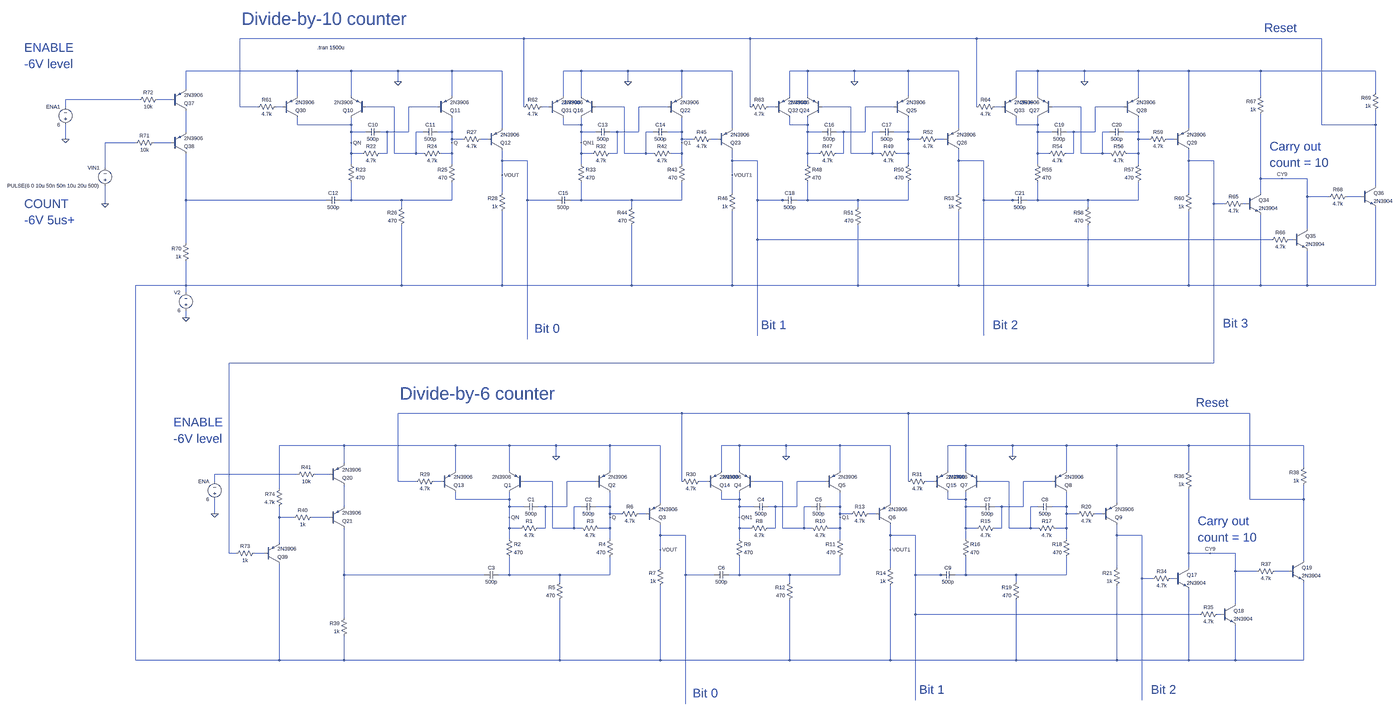
[diagram p0: schematic counter_div60.asc, whole sheet]
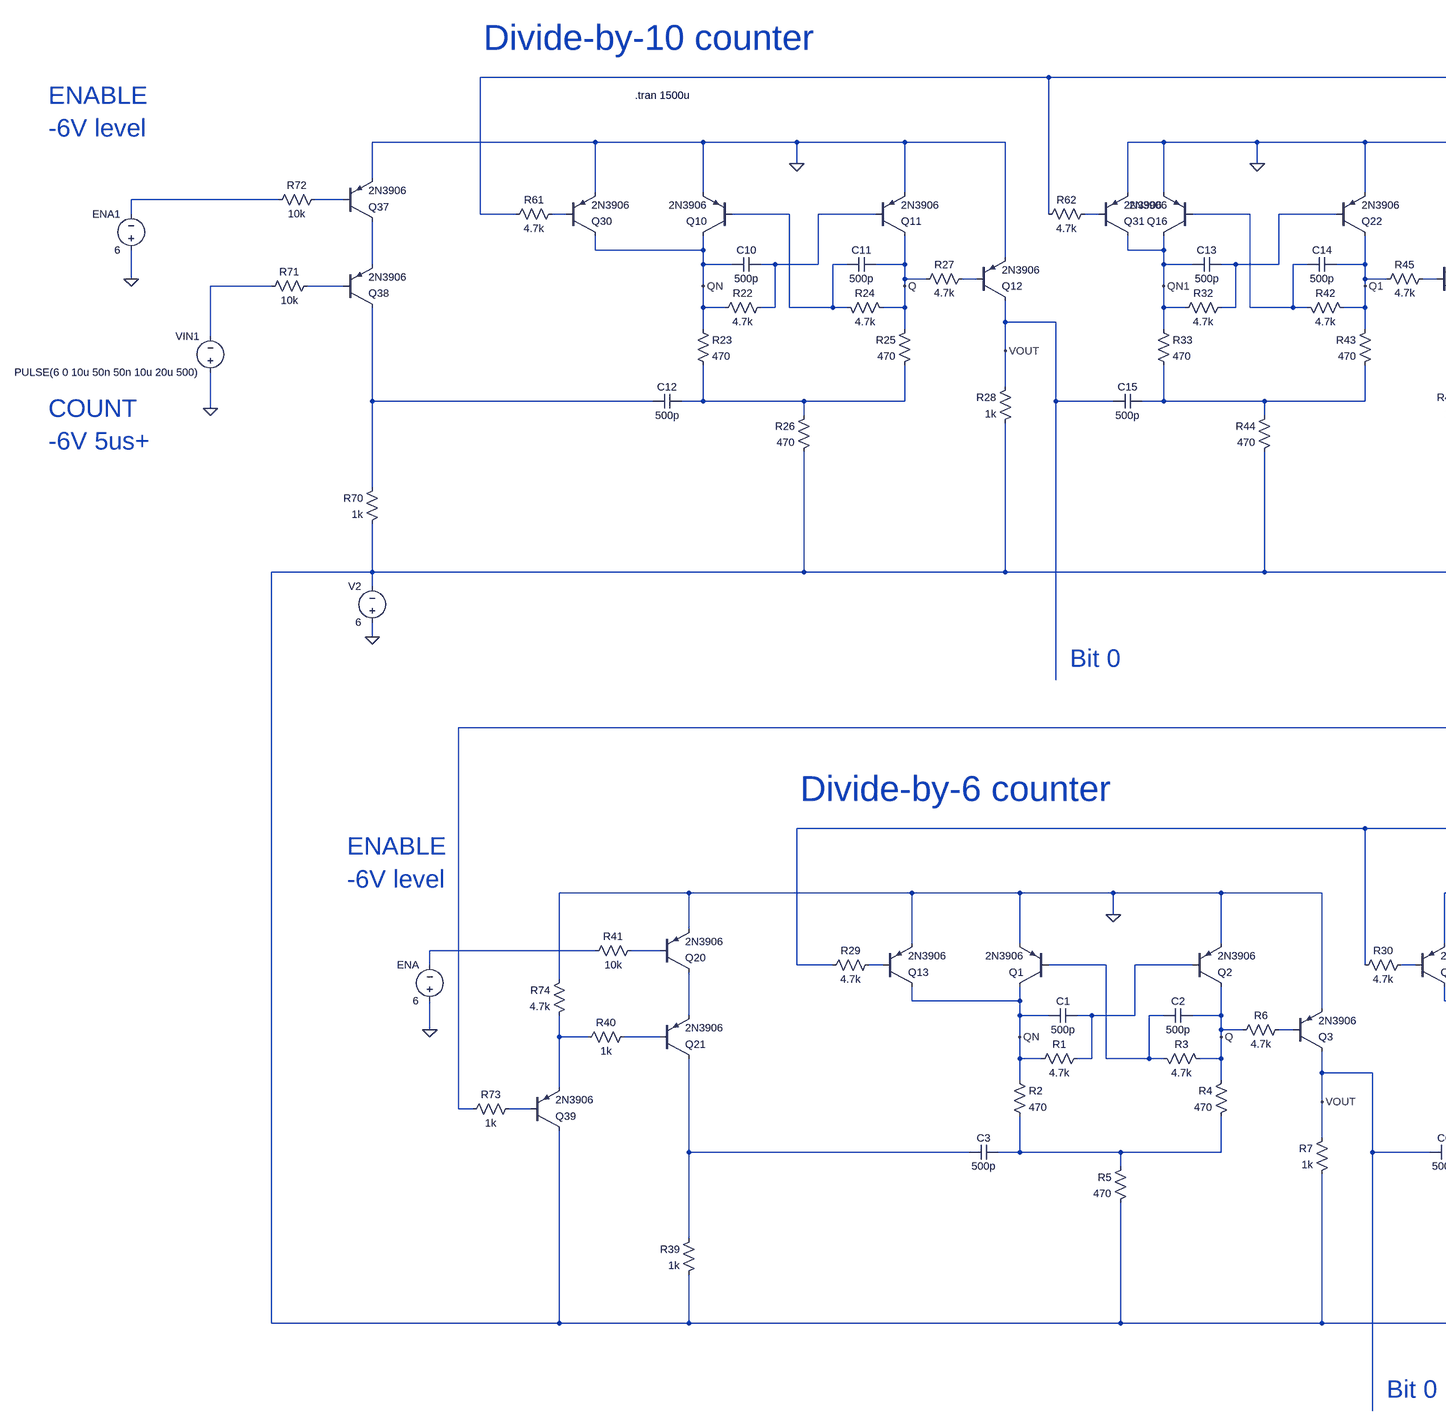
[diagram p1: schematic counter_div60.asc, part, row 1 of 1, column 1 of 2]
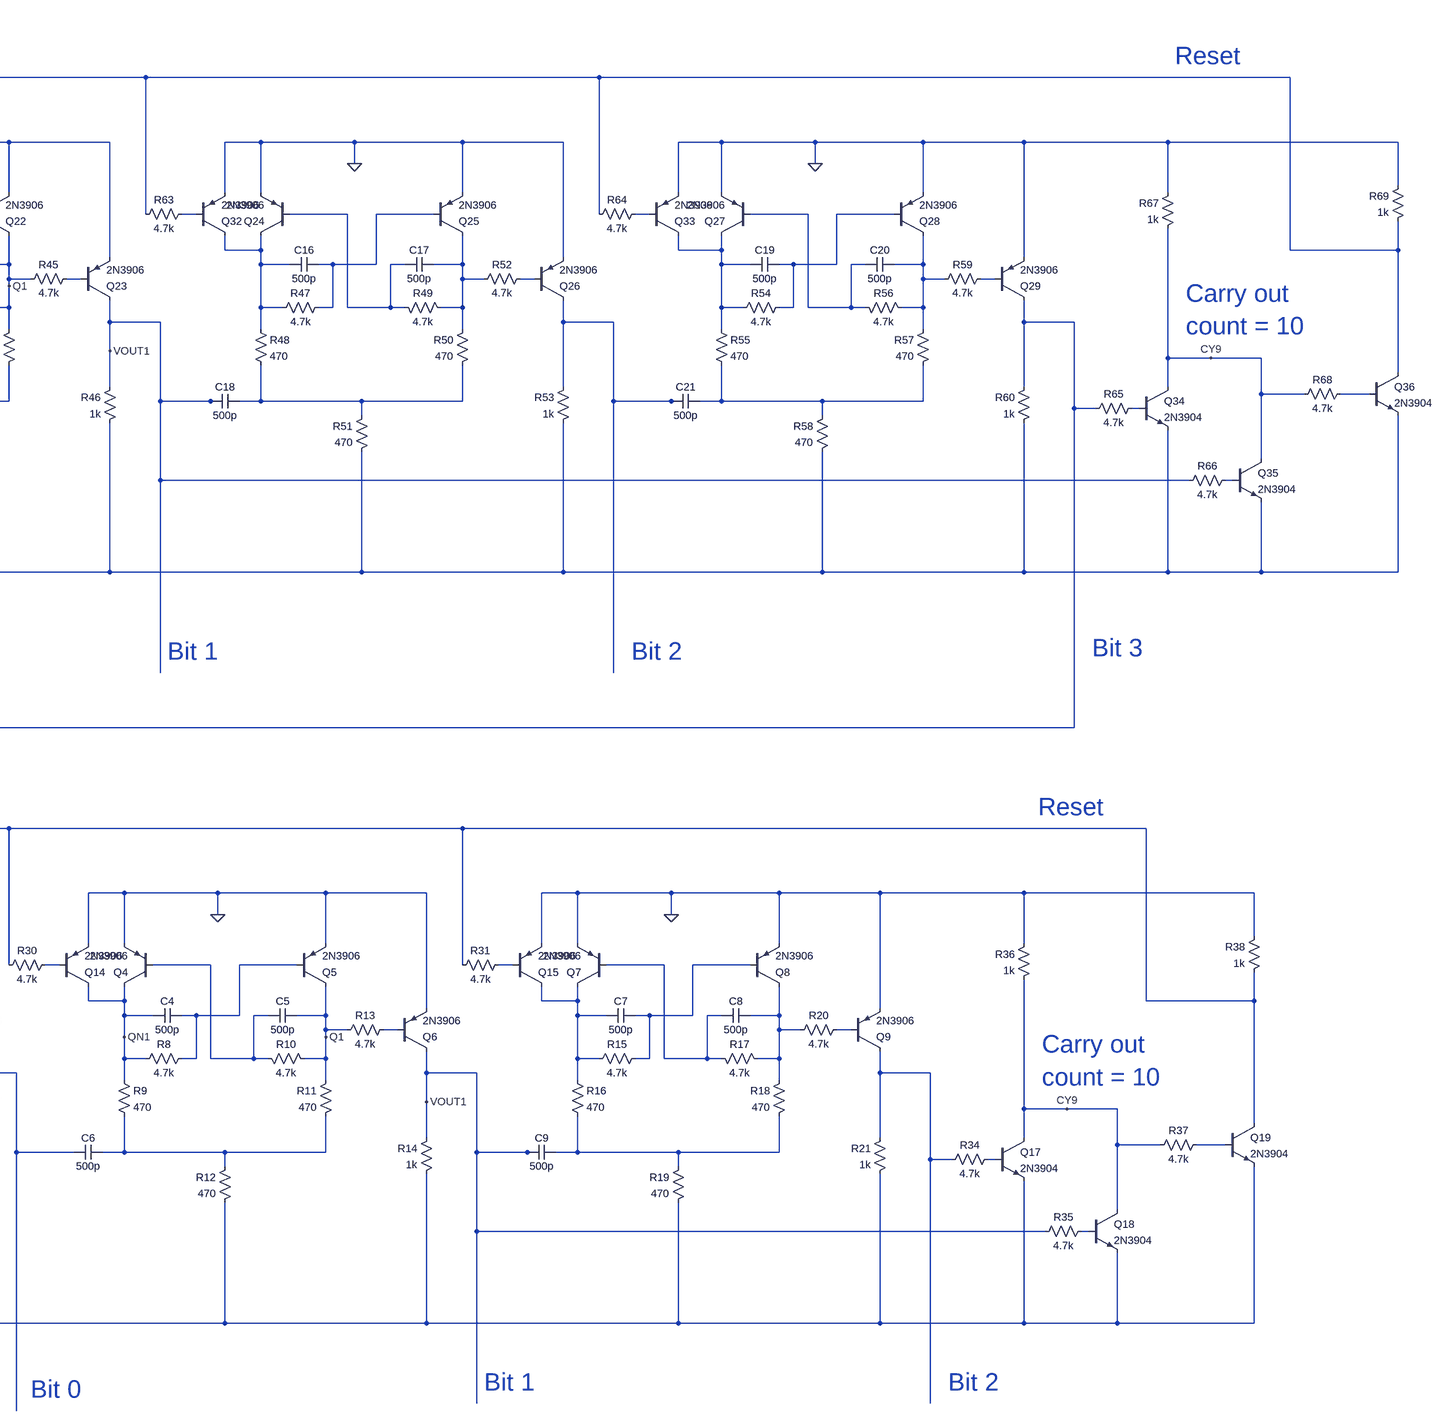
[diagram p2: schematic counter_div60.asc, part, row 1 of 1, column 2 of 2]
counter_div60.asc, the LTspice schematic file:
Version 4
SHEET 1 4888 1684
WIRE -16 -1984 -1280 -1984
WIRE 992 -1984 -16 -1984
WIRE 2000 -1984 992 -1984
WIRE 3536 -1984 2000 -1984
WIRE -1024 -1840 -1520 -1840
WIRE -784 -1840 -1024 -1840
WIRE -576 -1840 -784 -1840
WIRE -336 -1840 -576 -1840
WIRE -112 -1840 -336 -1840
WIRE 240 -1840 160 -1840
WIRE 448 -1840 240 -1840
WIRE 688 -1840 448 -1840
WIRE 912 -1840 688 -1840
WIRE 1248 -1840 1168 -1840
WIRE 1456 -1840 1248 -1840
WIRE 1696 -1840 1456 -1840
WIRE 1920 -1840 1696 -1840
WIRE 2272 -1840 2176 -1840
WIRE 2480 -1840 2272 -1840
WIRE 2720 -1840 2480 -1840
WIRE 2944 -1840 2720 -1840
WIRE 3264 -1840 2944 -1840
WIRE 3776 -1840 3264 -1840
WIRE -576 -1792 -576 -1840
WIRE 448 -1792 448 -1840
WIRE 1456 -1792 1456 -1840
WIRE 2480 -1792 2480 -1840
WIRE -1520 -1760 -1520 -1840
WIRE 3776 -1744 3776 -1840
WIRE -1024 -1728 -1024 -1840
WIRE -784 -1728 -784 -1840
WIRE -336 -1728 -336 -1840
WIRE 160 -1728 160 -1840
WIRE 240 -1728 240 -1840
WIRE 688 -1728 688 -1840
WIRE 1168 -1728 1168 -1840
WIRE 1248 -1728 1248 -1840
WIRE 1696 -1728 1696 -1840
WIRE 2176 -1728 2176 -1840
WIRE 2272 -1728 2272 -1840
WIRE 2720 -1728 2720 -1840
WIRE 3264 -1728 3264 -1840
WIRE -1728 -1712 -2096 -1712
WIRE -1584 -1712 -1648 -1712
WIRE -2096 -1680 -2096 -1712
WIRE -1280 -1680 -1280 -1984
WIRE -1200 -1680 -1280 -1680
WIRE -1088 -1680 -1120 -1680
WIRE -592 -1680 -720 -1680
WIRE -400 -1680 -528 -1680
WIRE -16 -1680 -16 -1984
WIRE 96 -1680 64 -1680
WIRE 432 -1680 304 -1680
WIRE 624 -1680 496 -1680
WIRE 992 -1680 992 -1984
WIRE 1104 -1680 1072 -1680
WIRE 1440 -1680 1312 -1680
WIRE 1632 -1680 1504 -1680
WIRE 2000 -1680 2000 -1984
WIRE 2112 -1680 2080 -1680
WIRE 2464 -1680 2336 -1680
WIRE 2656 -1680 2528 -1680
WIRE -1024 -1600 -1024 -1632
WIRE -784 -1600 -784 -1632
WIRE -784 -1600 -1024 -1600
WIRE 160 -1600 160 -1632
WIRE 240 -1600 240 -1632
WIRE 240 -1600 160 -1600
WIRE 1168 -1600 1168 -1632
WIRE 1248 -1600 1248 -1632
WIRE 1248 -1600 1168 -1600
WIRE 2176 -1600 2176 -1632
WIRE 2272 -1600 2272 -1632
WIRE 2272 -1600 2176 -1600
WIRE 3536 -1600 3536 -1984
WIRE 3776 -1600 3776 -1664
WIRE 3776 -1600 3536 -1600
WIRE -112 -1584 -112 -1840
WIRE 912 -1584 912 -1840
WIRE 1920 -1584 1920 -1840
WIRE 2944 -1584 2944 -1840
WIRE -1520 -1568 -1520 -1664
WIRE -784 -1568 -784 -1600
WIRE -720 -1568 -784 -1568
WIRE -624 -1568 -656 -1568
WIRE -528 -1568 -528 -1680
WIRE -528 -1568 -624 -1568
WIRE -464 -1568 -496 -1568
WIRE -336 -1568 -336 -1632
WIRE -336 -1568 -400 -1568
WIRE 240 -1568 240 -1600
WIRE 304 -1568 240 -1568
WIRE 400 -1568 368 -1568
WIRE 496 -1568 496 -1680
WIRE 496 -1568 400 -1568
WIRE 560 -1568 528 -1568
WIRE 688 -1568 688 -1632
WIRE 688 -1568 624 -1568
WIRE 1248 -1568 1248 -1600
WIRE 1312 -1568 1248 -1568
WIRE 1408 -1568 1376 -1568
WIRE 1504 -1568 1504 -1680
WIRE 1504 -1568 1408 -1568
WIRE 1568 -1568 1536 -1568
WIRE 1696 -1568 1696 -1632
WIRE 1696 -1568 1632 -1568
WIRE 2272 -1568 2272 -1600
WIRE 2336 -1568 2272 -1568
WIRE 2432 -1568 2400 -1568
WIRE 2528 -1568 2528 -1680
WIRE 2528 -1568 2432 -1568
WIRE 2592 -1568 2560 -1568
WIRE 2720 -1568 2720 -1632
WIRE 2720 -1568 2656 -1568
WIRE -2096 -1536 -2096 -1600
WIRE -336 -1536 -336 -1568
WIRE -288 -1536 -336 -1536
WIRE -176 -1536 -208 -1536
WIRE 688 -1536 688 -1568
WIRE 736 -1536 688 -1536
WIRE 848 -1536 816 -1536
WIRE 1696 -1536 1696 -1568
WIRE 1744 -1536 1696 -1536
WIRE 1856 -1536 1824 -1536
WIRE 2720 -1536 2720 -1568
WIRE 2768 -1536 2720 -1536
WIRE 2880 -1536 2848 -1536
WIRE -1744 -1520 -1920 -1520
WIRE -1584 -1520 -1664 -1520
WIRE -784 -1520 -784 -1568
WIRE -336 -1520 -336 -1536
WIRE 240 -1520 240 -1568
WIRE 688 -1520 688 -1536
WIRE -784 -1472 -784 -1520
WIRE -736 -1472 -784 -1472
WIRE -624 -1472 -624 -1568
WIRE -624 -1472 -656 -1472
WIRE -592 -1472 -592 -1680
WIRE -496 -1472 -496 -1568
WIRE -496 -1472 -592 -1472
WIRE -464 -1472 -496 -1472
WIRE -336 -1472 -336 -1520
WIRE -336 -1472 -384 -1472
WIRE 240 -1472 240 -1520
WIRE 288 -1472 240 -1472
WIRE 400 -1472 400 -1568
WIRE 400 -1472 368 -1472
WIRE 432 -1472 432 -1680
WIRE 528 -1472 528 -1568
WIRE 528 -1472 432 -1472
WIRE 560 -1472 528 -1472
WIRE 688 -1472 688 -1520
WIRE 688 -1472 640 -1472
WIRE 1248 -1472 1248 -1568
WIRE 1296 -1472 1248 -1472
WIRE 1408 -1472 1408 -1568
WIRE 1408 -1472 1376 -1472
WIRE 1440 -1472 1440 -1680
WIRE 1536 -1472 1536 -1568
WIRE 1536 -1472 1440 -1472
WIRE 1568 -1472 1536 -1472
WIRE 1696 -1472 1696 -1536
WIRE 1696 -1472 1648 -1472
WIRE 2272 -1472 2272 -1568
WIRE 2320 -1472 2272 -1472
WIRE 2432 -1472 2432 -1568
WIRE 2432 -1472 2400 -1472
WIRE 2464 -1472 2464 -1680
WIRE 2560 -1472 2560 -1568
WIRE 2560 -1472 2464 -1472
WIRE 2592 -1472 2560 -1472
WIRE 2720 -1472 2720 -1536
WIRE 2720 -1472 2672 -1472
WIRE -112 -1440 -112 -1488
WIRE 0 -1440 -112 -1440
WIRE 912 -1440 912 -1488
WIRE 1024 -1440 912 -1440
WIRE 1920 -1440 1920 -1488
WIRE 2032 -1440 1920 -1440
WIRE 2944 -1440 2944 -1488
WIRE 3056 -1440 2944 -1440
WIRE -784 -1424 -784 -1472
WIRE -336 -1424 -336 -1472
WIRE 240 -1424 240 -1472
WIRE 688 -1424 688 -1472
WIRE 1248 -1424 1248 -1472
WIRE 1696 -1424 1696 -1472
WIRE 2272 -1424 2272 -1472
WIRE 2720 -1424 2720 -1472
WIRE -1920 -1408 -1920 -1520
WIRE -112 -1376 -112 -1440
WIRE 912 -1376 912 -1440
WIRE 3264 -1360 3264 -1648
WIRE 3360 -1360 3264 -1360
WIRE 3472 -1360 3360 -1360
WIRE 3776 -1328 3776 -1600
WIRE -112 -1296 -112 -1376
WIRE 912 -1296 912 -1376
WIRE 1920 -1296 1920 -1440
WIRE 2944 -1296 2944 -1440
WIRE 3264 -1296 3264 -1360
WIRE 3472 -1280 3472 -1360
WIRE 3568 -1280 3472 -1280
WIRE 3712 -1280 3648 -1280
WIRE -1520 -1264 -1520 -1472
WIRE -896 -1264 -1520 -1264
WIRE -784 -1264 -784 -1344
WIRE -784 -1264 -832 -1264
WIRE -560 -1264 -784 -1264
WIRE -336 -1264 -336 -1344
WIRE -336 -1264 -560 -1264
WIRE 0 -1264 0 -1440
WIRE 128 -1264 0 -1264
WIRE 240 -1264 240 -1344
WIRE 240 -1264 192 -1264
WIRE 464 -1264 240 -1264
WIRE 688 -1264 688 -1344
WIRE 688 -1264 464 -1264
WIRE 1024 -1264 1024 -1440
WIRE 1136 -1264 1024 -1264
WIRE 1152 -1264 1136 -1264
WIRE 1248 -1264 1248 -1344
WIRE 1248 -1264 1200 -1264
WIRE 1472 -1264 1248 -1264
WIRE 1696 -1264 1696 -1344
WIRE 1696 -1264 1472 -1264
WIRE 2032 -1264 2032 -1440
WIRE 2160 -1264 2032 -1264
WIRE 2176 -1264 2160 -1264
WIRE 2272 -1264 2272 -1344
WIRE 2272 -1264 2224 -1264
WIRE 2496 -1264 2272 -1264
WIRE 2720 -1264 2720 -1344
WIRE 2720 -1264 2496 -1264
WIRE -1920 -1248 -1920 -1328
WIRE 3056 -1248 3056 -1440
WIRE 3104 -1248 3056 -1248
WIRE 3200 -1248 3184 -1248
WIRE -560 -1232 -560 -1264
WIRE 464 -1232 464 -1264
WIRE 1472 -1232 1472 -1264
WIRE 2496 -1232 2496 -1264
WIRE 3472 -1136 3472 -1280
WIRE 1024 -1088 1024 -1264
WIRE 3312 -1088 1024 -1088
WIRE 3408 -1088 3392 -1088
WIRE -1520 -1072 -1520 -1264
WIRE -1520 -864 -1520 -992
WIRE -1520 -864 -1744 -864
WIRE -560 -864 -560 -1152
WIRE -560 -864 -1520 -864
WIRE -112 -864 -112 -1216
WIRE -112 -864 -560 -864
WIRE 464 -864 464 -1152
WIRE 464 -864 -112 -864
WIRE 912 -864 912 -1216
WIRE 912 -864 464 -864
WIRE 1472 -864 1472 -1152
WIRE 1472 -864 912 -864
WIRE 1920 -864 1920 -1216
WIRE 1920 -864 1472 -864
WIRE 2496 -864 2496 -1152
WIRE 2496 -864 1920 -864
WIRE 2944 -864 2944 -1216
WIRE 2944 -864 2496 -864
WIRE 3264 -864 3264 -1200
WIRE 3264 -864 2944 -864
WIRE 3472 -864 3472 -1040
WIRE 3472 -864 3264 -864
WIRE 3776 -864 3776 -1232
WIRE 3776 -864 3472 -864
WIRE -1520 -832 -1520 -864
WIRE -1520 -720 -1520 -752
WIRE 1024 -640 1024 -1088
WIRE 2032 -640 2032 -1264
WIRE 0 -624 0 -1264
WIRE 3056 -448 3056 -1248
WIRE 3056 -448 -1328 -448
WIRE 688 -96 -576 -96
WIRE 1696 -96 688 -96
WIRE 3216 -96 1696 -96
WIRE -816 48 -1104 48
WIRE -320 48 -816 48
WIRE -80 48 -320 48
WIRE 128 48 -80 48
WIRE 368 48 128 48
WIRE 592 48 368 48
WIRE 944 48 864 48
WIRE 1152 48 944 48
WIRE 1392 48 1152 48
WIRE 1616 48 1392 48
WIRE 1952 48 1872 48
WIRE 2160 48 1952 48
WIRE 2400 48 2160 48
WIRE 2624 48 2400 48
WIRE 2944 48 2624 48
WIRE 3456 48 2944 48
WIRE 128 96 128 48
WIRE 1152 96 1152 48
WIRE 2160 96 2160 48
WIRE -816 128 -816 48
WIRE 3456 144 3456 48
WIRE -320 160 -320 48
WIRE -80 160 -80 48
WIRE 368 160 368 48
WIRE 864 160 864 48
WIRE 944 160 944 48
WIRE 1392 160 1392 48
WIRE 1872 160 1872 48
WIRE 1952 160 1952 48
WIRE 2400 160 2400 48
WIRE 2944 160 2944 48
WIRE -1024 176 -1392 176
WIRE -880 176 -944 176
WIRE -1392 208 -1392 176
WIRE -576 208 -576 -96
WIRE -496 208 -576 208
WIRE -384 208 -416 208
WIRE 112 208 -16 208
WIRE 304 208 176 208
WIRE 688 208 688 -96
WIRE 800 208 768 208
WIRE 1136 208 1008 208
WIRE 1328 208 1200 208
WIRE 1696 208 1696 -96
WIRE 1808 208 1776 208
WIRE 2144 208 2016 208
WIRE 2336 208 2208 208
WIRE -1104 240 -1104 48
WIRE -320 288 -320 256
WIRE -80 288 -80 256
WIRE -80 288 -320 288
WIRE 864 288 864 256
WIRE 944 288 944 256
WIRE 944 288 864 288
WIRE 1872 288 1872 256
WIRE 1952 288 1952 256
WIRE 1952 288 1872 288
WIRE 3216 288 3216 -96
WIRE 3456 288 3456 224
WIRE 3456 288 3216 288
WIRE 592 304 592 48
WIRE 1616 304 1616 48
WIRE 2624 304 2624 48
WIRE -816 320 -816 224
WIRE -80 320 -80 288
WIRE -16 320 -80 320
WIRE 80 320 48 320
WIRE 176 320 176 208
WIRE 176 320 80 320
WIRE 240 320 208 320
WIRE 368 320 368 256
WIRE 368 320 304 320
WIRE 944 320 944 288
WIRE 1008 320 944 320
WIRE 1104 320 1072 320
WIRE 1200 320 1200 208
WIRE 1200 320 1104 320
WIRE 1264 320 1232 320
WIRE 1392 320 1392 256
WIRE 1392 320 1328 320
WIRE 1952 320 1952 288
WIRE 2016 320 1952 320
WIRE 2112 320 2080 320
WIRE 2208 320 2208 208
WIRE 2208 320 2112 320
WIRE 2272 320 2240 320
WIRE 2400 320 2400 256
WIRE 2400 320 2336 320
WIRE -1392 352 -1392 288
WIRE 368 352 368 320
WIRE 416 352 368 352
WIRE 528 352 496 352
WIRE 1392 352 1392 320
WIRE 1440 352 1392 352
WIRE 1552 352 1520 352
WIRE 2400 352 2400 320
WIRE 2448 352 2400 352
WIRE 2560 352 2528 352
WIRE -1104 368 -1104 320
WIRE -1040 368 -1104 368
WIRE -880 368 -960 368
WIRE -80 368 -80 320
WIRE 368 368 368 352
WIRE 944 368 944 320
WIRE 1392 368 1392 352
WIRE -80 416 -80 368
WIRE -32 416 -80 416
WIRE 80 416 80 320
WIRE 80 416 48 416
WIRE 112 416 112 208
WIRE 208 416 208 320
WIRE 208 416 112 416
WIRE 240 416 208 416
WIRE 368 416 368 368
WIRE 368 416 320 416
WIRE 944 416 944 368
WIRE 992 416 944 416
WIRE 1104 416 1104 320
WIRE 1104 416 1072 416
WIRE 1136 416 1136 208
WIRE 1232 416 1232 320
WIRE 1232 416 1136 416
WIRE 1264 416 1232 416
WIRE 1392 416 1392 368
WIRE 1392 416 1344 416
WIRE 1952 416 1952 320
WIRE 2000 416 1952 416
WIRE 2112 416 2112 320
WIRE 2112 416 2080 416
WIRE 2144 416 2144 208
WIRE 2240 416 2240 320
WIRE 2240 416 2144 416
WIRE 2272 416 2240 416
WIRE 2400 416 2400 352
WIRE 2400 416 2352 416
WIRE 592 448 592 400
WIRE 704 448 592 448
WIRE 1616 448 1616 400
WIRE 1728 448 1616 448
WIRE 2624 448 2624 400
WIRE 2736 448 2624 448
WIRE -80 464 -80 416
WIRE 368 464 368 416
WIRE 944 464 944 416
WIRE 1392 464 1392 416
WIRE 1952 464 1952 416
WIRE 2400 464 2400 416
WIRE -1104 480 -1104 368
WIRE 592 512 592 448
WIRE 1616 512 1616 448
WIRE -1328 528 -1328 -448
WIRE -1296 528 -1328 528
WIRE -1168 528 -1216 528
WIRE 2944 528 2944 240
WIRE 3040 528 2944 528
WIRE 3152 528 3040 528
WIRE 3456 560 3456 288
WIRE 592 592 592 512
WIRE 1616 592 1616 512
WIRE 2624 592 2624 448
WIRE 2944 592 2944 528
WIRE 3152 608 3152 528
WIRE 3248 608 3152 608
WIRE 3392 608 3328 608
WIRE -816 624 -816 416
WIRE -192 624 -816 624
WIRE -80 624 -80 544
WIRE -80 624 -128 624
WIRE 144 624 -80 624
WIRE 368 624 368 544
WIRE 368 624 144 624
WIRE 704 624 704 448
WIRE 832 624 704 624
WIRE 944 624 944 544
WIRE 944 624 896 624
WIRE 1168 624 944 624
WIRE 1392 624 1392 544
WIRE 1392 624 1168 624
WIRE 1728 624 1728 448
WIRE 1840 624 1728 624
WIRE 1856 624 1840 624
WIRE 1952 624 1952 544
WIRE 1952 624 1904 624
WIRE 2176 624 1952 624
WIRE 2400 624 2400 544
WIRE 2400 624 2176 624
WIRE 2736 640 2736 448
WIRE 2784 640 2736 640
WIRE 2880 640 2864 640
WIRE 144 656 144 624
WIRE 1168 656 1168 624
WIRE 2176 656 2176 624
WIRE 3152 752 3152 608
WIRE 1728 800 1728 624
WIRE 2992 800 1728 800
WIRE 3088 800 3072 800
WIRE -816 816 -816 624
WIRE -1744 1024 -1744 -864
WIRE -1104 1024 -1104 576
WIRE -1104 1024 -1744 1024
WIRE -816 1024 -816 896
WIRE -816 1024 -1104 1024
WIRE 144 1024 144 736
WIRE 144 1024 -816 1024
WIRE 592 1024 592 672
WIRE 592 1024 144 1024
WIRE 1168 1024 1168 736
WIRE 1168 1024 592 1024
WIRE 1616 1024 1616 672
WIRE 1616 1024 1168 1024
WIRE 2176 1024 2176 736
WIRE 2176 1024 1616 1024
WIRE 2624 1024 2624 672
WIRE 2624 1024 2176 1024
WIRE 2944 1024 2944 688
WIRE 2944 1024 2624 1024
WIRE 3152 1024 3152 848
WIRE 3152 1024 2944 1024
WIRE 3456 1024 3456 656
WIRE 3456 1024 3152 1024
WIRE 1728 1248 1728 800
WIRE 2736 1248 2736 640
WIRE 704 1264 704 624
FLAG 128 96 0
FLAG 368 368 Q
FLAG -80 368 QN
FLAG 592 512 VOUT
FLAG 1152 96 0
FLAG 1392 368 Q1
FLAG 944 368 QN1
FLAG 1616 512 VOUT1
FLAG 2160 96 0
FLAG 3040 528 CY9
FLAG -1392 352 0
FLAG -576 -1792 0
FLAG -1520 -720 0
FLAG -1920 -1248 0
FLAG -336 -1520 Q
FLAG -784 -1520 QN
FLAG -112 -1376 VOUT
FLAG 448 -1792 0
FLAG 688 -1520 Q1
FLAG 240 -1520 QN1
FLAG 912 -1376 VOUT1
FLAG 1456 -1792 0
FLAG 2480 -1792 0
FLAG 3360 -1360 CY9
FLAG -2096 -1536 0
SYMBOL pnp -16 256 R180
SYMATTR InstName Q1
SYMATTR Value 2N3906
SYMBOL cap 48 304 R90
WINDOW 0 0 32 VBottom 2
WINDOW 3 32 32 VTop 2
SYMATTR InstName C1
SYMATTR Value 500p
SYMBOL res 64 400 R90
WINDOW 0 0 56 VBottom 2
WINDOW 3 32 56 VTop 2
SYMATTR InstName R1
SYMATTR Value 4.7k
SYMBOL res -96 448 R0
SYMATTR InstName R2
SYMATTR Value 470
SYMBOL pnp 304 256 M180
SYMATTR InstName Q2
SYMATTR Value 2N3906
SYMBOL cap 240 304 M90
WINDOW 0 0 32 VBottom 2
WINDOW 3 32 32 VTop 2
SYMATTR InstName C2
SYMATTR Value 500p
SYMBOL res 224 400 M90
WINDOW 0 0 56 VBottom 2
WINDOW 3 32 56 VTop 2
SYMATTR InstName R3
SYMATTR Value 4.7k
SYMBOL res 384 448 M0
SYMATTR InstName R4
SYMATTR Value 470
SYMBOL res 160 640 M0
SYMATTR InstName R5
SYMATTR Value 470
SYMBOL cap -128 608 R90
WINDOW 0 0 32 VBottom 2
WINDOW 3 32 32 VTop 2
SYMATTR InstName C3
SYMATTR Value 500p
SYMBOL pnp 528 400 M180
SYMATTR InstName Q3
SYMATTR Value 2N3906
SYMBOL res 512 336 R90
WINDOW 0 0 56 VBottom 2
WINDOW 3 32 56 VTop 2
SYMATTR InstName R6
SYMATTR Value 4.7k
SYMBOL res 608 576 M0
SYMATTR InstName R7
SYMATTR Value 1k
SYMBOL pnp 1008 256 R180
SYMATTR InstName Q4
SYMATTR Value 2N3906
SYMBOL cap 1072 304 R90
WINDOW 0 0 32 VBottom 2
WINDOW 3 32 32 VTop 2
SYMATTR InstName C4
SYMATTR Value 500p
SYMBOL res 1088 400 R90
WINDOW 0 0 56 VBottom 2
WINDOW 3 32 56 VTop 2
SYMATTR InstName R8
SYMATTR Value 4.7k
SYMBOL res 928 448 R0
SYMATTR InstName R9
SYMATTR Value 470
SYMBOL pnp 1328 256 M180
SYMATTR InstName Q5
SYMATTR Value 2N3906
SYMBOL cap 1264 304 M90
WINDOW 0 0 32 VBottom 2
WINDOW 3 32 32 VTop 2
SYMATTR InstName C5
SYMATTR Value 500p
SYMBOL res 1248 400 M90
WINDOW 0 0 56 VBottom 2
WINDOW 3 32 56 VTop 2
SYMATTR InstName R10
SYMATTR Value 4.7k
SYMBOL res 1408 448 M0
SYMATTR InstName R11
SYMATTR Value 470
SYMBOL res 1184 640 M0
SYMATTR InstName R12
SYMATTR Value 470
SYMBOL cap 896 608 R90
WINDOW 0 0 32 VBottom 2
WINDOW 3 32 32 VTop 2
SYMATTR InstName C6
SYMATTR Value 500p
SYMBOL pnp 1552 400 M180
SYMATTR InstName Q6
SYMATTR Value 2N3906
SYMBOL res 1536 336 R90
WINDOW 0 0 56 VBottom 2
WINDOW 3 32 56 VTop 2
SYMATTR InstName R13
SYMATTR Value 4.7k
SYMBOL res 1632 576 M0
SYMATTR InstName R14
SYMATTR Value 1k
SYMBOL pnp 2016 256 R180
SYMATTR InstName Q7
SYMATTR Value 2N3906
SYMBOL cap 2080 304 R90
WINDOW 0 0 32 VBottom 2
WINDOW 3 32 32 VTop 2
SYMATTR InstName C7
SYMATTR Value 500p
SYMBOL res 2096 400 R90
WINDOW 0 0 56 VBottom 2
WINDOW 3 32 56 VTop 2
SYMATTR InstName R15
SYMATTR Value 4.7k
SYMBOL res 1936 448 R0
SYMATTR InstName R16
SYMATTR Value 470
SYMBOL pnp 2336 256 M180
SYMATTR InstName Q8
SYMATTR Value 2N3906
SYMBOL cap 2272 304 M90
WINDOW 0 0 32 VBottom 2
WINDOW 3 32 32 VTop 2
SYMATTR InstName C8
SYMATTR Value 500p
SYMBOL res 2256 400 M90
WINDOW 0 0 56 VBottom 2
WINDOW 3 32 56 VTop 2
SYMATTR InstName R17
SYMATTR Value 4.7k
SYMBOL res 2416 448 M0
SYMATTR InstName R18
SYMATTR Value 470
SYMBOL res 2192 640 M0
SYMATTR InstName R19
SYMATTR Value 470
SYMBOL cap 1904 608 R90
WINDOW 0 0 32 VBottom 2
WINDOW 3 32 32 VTop 2
SYMATTR InstName C9
SYMATTR Value 500p
SYMBOL pnp 2560 400 M180
SYMATTR InstName Q9
SYMATTR Value 2N3906
SYMBOL res 2544 336 R90
WINDOW 0 0 56 VBottom 2
WINDOW 3 32 56 VTop 2
SYMATTR InstName R20
SYMATTR Value 4.7k
SYMBOL res 2640 576 M0
SYMATTR InstName R21
SYMATTR Value 1k
SYMBOL pnp -384 256 M180
SYMATTR InstName Q13
SYMATTR Value 2N3906
SYMBOL res -400 192 R90
WINDOW 0 0 56 VBottom 2
WINDOW 3 32 56 VTop 2
SYMATTR InstName R29
SYMATTR Value 4.7k
SYMBOL pnp 800 256 M180
SYMATTR InstName Q14
SYMATTR Value 2N3906
SYMBOL res 784 192 R90
WINDOW 0 0 56 VBottom 2
WINDOW 3 32 56 VTop 2
SYMATTR InstName R30
SYMATTR Value 4.7k
SYMBOL pnp 1808 256 M180
SYMATTR InstName Q15
SYMATTR Value 2N3906
SYMBOL res 1792 192 R90
WINDOW 0 0 56 VBottom 2
WINDOW 3 32 56 VTop 2
SYMATTR InstName R31
SYMATTR Value 4.7k
SYMBOL res 2880 624 R90
WINDOW 0 0 56 VBottom 2
WINDOW 3 32 56 VTop 2
SYMATTR InstName R34
SYMATTR Value 4.7k
SYMBOL res 3088 784 R90
WINDOW 0 0 56 VBottom 2
WINDOW 3 32 56 VTop 2
SYMATTR InstName R35
SYMATTR Value 4.7k
SYMBOL npn 2880 592 R0
SYMATTR InstName Q17
SYMATTR Value 2N3904
SYMBOL npn 3088 752 R0
SYMATTR InstName Q18
SYMATTR Value 2N3904
SYMBOL res 2960 144 M0
SYMATTR InstName R36
SYMATTR Value 1k
SYMBOL npn 3392 560 R0
SYMATTR InstName Q19
SYMATTR Value 2N3904
SYMBOL res 3344 592 R90
WINDOW 0 0 56 VBottom 2
WINDOW 3 32 56 VTop 2
SYMATTR InstName R37
SYMATTR Value 4.7k
SYMBOL res 3472 128 M0
SYMATTR InstName R38
SYMATTR Value 1k
SYMBOL pnp -880 224 M180
SYMATTR InstName Q20
SYMATTR Value 2N3906
SYMBOL pnp -880 416 M180
SYMATTR InstName Q21
SYMATTR Value 2N3906
SYMBOL res -800 800 M0
SYMATTR InstName R39
SYMATTR Value 1k
SYMBOL res -944 352 R90
WINDOW 0 0 56 VBottom 2
WINDOW 3 32 56 VTop 2
SYMATTR InstName R40
SYMATTR Value 1k
SYMBOL voltage -1392 304 R180
WINDOW 0 24 96 Left 2
WINDOW 3 24 16 Left 2
WINDOW 123 0 0 Left 0
WINDOW 39 0 0 Left 0
SYMATTR InstName ENA
SYMATTR Value 6
SYMBOL res -928 160 R90
WINDOW 0 0 56 VBottom 2
WINDOW 3 32 56 VTop 2
SYMATTR InstName R41
SYMATTR Value 10k
SYMBOL pnp -720 -1632 R180
SYMATTR InstName Q10
SYMATTR Value 2N3906
SYMBOL cap -656 -1584 R90
WINDOW 0 0 32 VBottom 2
WINDOW 3 32 32 VTop 2
SYMATTR InstName C10
SYMATTR Value 500p
SYMBOL res -640 -1488 R90
WINDOW 0 0 56 VBottom 2
WINDOW 3 32 56 VTop 2
SYMATTR InstName R22
SYMATTR Value 4.7k
SYMBOL res -800 -1440 R0
SYMATTR InstName R23
SYMATTR Value 470
SYMBOL pnp -400 -1632 M180
SYMATTR InstName Q11
SYMATTR Value 2N3906
SYMBOL cap -464 -1584 M90
WINDOW 0 0 32 VBottom 2
WINDOW 3 32 32 VTop 2
SYMATTR InstName C11
SYMATTR Value 500p
SYMBOL res -480 -1488 M90
WINDOW 0 0 56 VBottom 2
WINDOW 3 32 56 VTop 2
SYMATTR InstName R24
SYMATTR Value 4.7k
SYMBOL res -320 -1440 M0
SYMATTR InstName R25
SYMATTR Value 470
SYMBOL res -544 -1248 M0
SYMATTR InstName R26
SYMATTR Value 470
SYMBOL cap -832 -1280 R90
WINDOW 0 0 32 VBottom 2
WINDOW 3 32 32 VTop 2
SYMATTR InstName C12
SYMATTR Value 500p
SYMBOL voltage -1520 -736 R180
WINDOW 0 24 96 Left 2
WINDOW 3 24 16 Left 2
WINDOW 123 0 0 Left 0
WINDOW 39 0 0 Left 0
SYMATTR InstName V2
SYMATTR Value 6
SYMBOL voltage -1920 -1312 R180
WINDOW 0 24 96 Left 2
WINDOW 3 24 16 Left 2
WINDOW 123 0 0 Left 0
WINDOW 39 0 0 Left 0
SYMATTR InstName VIN1
SYMATTR Value PULSE(6 0 10u 50n 50n 10u 20u 500)
SYMBOL pnp -176 -1488 M180
SYMATTR InstName Q12
SYMATTR Value 2N3906
SYMBOL res -192 -1552 R90
WINDOW 0 0 56 VBottom 2
WINDOW 3 32 56 VTop 2
SYMATTR InstName R27
SYMATTR Value 4.7k
SYMBOL res -96 -1312 M0
SYMATTR InstName R28
SYMATTR Value 1k
SYMBOL pnp 304 -1632 R180
SYMATTR InstName Q16
SYMATTR Value 2N3906
SYMBOL cap 368 -1584 R90
WINDOW 0 0 32 VBottom 2
WINDOW 3 32 32 VTop 2
SYMATTR InstName C13
SYMATTR Value 500p
SYMBOL res 384 -1488 R90
WINDOW 0 0 56 VBottom 2
WINDOW 3 32 56 VTop 2
SYMATTR InstName R32
SYMATTR Value 4.7k
SYMBOL res 224 -1440 R0
SYMATTR InstName R33
SYMATTR Value 470
SYMBOL pnp 624 -1632 M180
SYMATTR InstName Q22
SYMATTR Value 2N3906
SYMBOL cap 560 -1584 M90
WINDOW 0 0 32 VBottom 2
WINDOW 3 32 32 VTop 2
SYMATTR InstName C14
SYMATTR Value 500p
SYMBOL res 544 -1488 M90
WINDOW 0 0 56 VBottom 2
WINDOW 3 32 56 VTop 2
SYMATTR InstName R42
SYMATTR Value 4.7k
SYMBOL res 704 -1440 M0
SYMATTR InstName R43
SYMATTR Value 470
SYMBOL res 480 -1248 M0
SYMATTR InstName R44
SYMATTR Value 470
SYMBOL cap 192 -1280 R90
WINDOW 0 0 32 VBottom 2
WINDOW 3 32 32 VTop 2
SYMATTR InstName C15
SYMATTR Value 500p
SYMBOL pnp 848 -1488 M180
SYMATTR InstName Q23
SYMATTR Value 2N3906
SYMBOL res 832 -1552 R90
WINDOW 0 0 56 VBottom 2
WINDOW 3 32 56 VTop 2
SYMATTR InstName R45
SYMATTR Value 4.7k
SYMBOL res 928 -1312 M0
SYMATTR InstName R46
SYMATTR Value 1k
SYMBOL pnp 1312 -1632 R180
SYMATTR InstName Q24
SYMATTR Value 2N3906
SYMBOL cap 1376 -1584 R90
WINDOW 0 0 32 VBottom 2
WINDOW 3 32 32 VTop 2
SYMATTR InstName C16
SYMATTR Value 500p
SYMBOL res 1392 -1488 R90
WINDOW 0 0 56 VBottom 2
WINDOW 3 32 56 VTop 2
SYMATTR InstName R47
SYMATTR Value 4.7k
SYMBOL res 1232 -1440 R0
SYMATTR InstName R48
SYMATTR Value 470
SYMBOL pnp 1632 -1632 M180
SYMATTR InstName Q25
SYMATTR Value 2N3906
SYMBOL cap 1568 -1584 M90
WINDOW 0 0 32 VBottom 2
WINDOW 3 32 32 VTop 2
SYMATTR InstName C17
SYMATTR Value 500p
SYMBOL res 1552 -1488 M90
WINDOW 0 0 56 VBottom 2
WINDOW 3 32 56 VTop 2
SYMATTR InstName R49
SYMATTR Value 4.7k
SYMBOL res 1712 -1440 M0
SYMATTR InstName R50
SYMATTR Value 470
SYMBOL res 1488 -1248 M0
SYMATTR InstName R51
SYMATTR Value 470
SYMBOL cap 1200 -1280 R90
WINDOW 0 0 32 VBottom 2
WINDOW 3 32 32 VTop 2
SYMATTR InstName C18
SYMATTR Value 500p
SYMBOL pnp 1856 -1488 M180
SYMATTR InstName Q26
SYMATTR Value 2N3906
SYMBOL res 1840 -1552 R90
WINDOW 0 0 56 VBottom 2
WINDOW 3 32 56 VTop 2
SYMATTR InstName R52
SYMATTR Value 4.7k
SYMBOL res 1936 -1312 M0
SYMATTR InstName R53
SYMATTR Value 1k
SYMBOL pnp 2336 -1632 R180
SYMATTR InstName Q27
SYMATTR Value 2N3906
SYMBOL cap 2400 -1584 R90
WINDOW 0 0 32 VBottom 2
WINDOW 3 32 32 VTop 2
SYMATTR InstName C19
SYMATTR Value 500p
SYMBOL res 2416 -1488 R90
WINDOW 0 0 56 VBottom 2
WINDOW 3 32 56 VTop 2
SYMATTR InstName R54
SYMATTR Value 4.7k
SYMBOL res 2256 -1440 R0
SYMATTR InstName R55
SYMATTR Value 470
SYMBOL pnp 2656 -1632 M180
SYMATTR InstName Q28
SYMATTR Value 2N3906
SYMBOL cap 2592 -1584 M90
WINDOW 0 0 32 VBottom 2
WINDOW 3 32 32 VTop 2
SYMATTR InstName C20
SYMATTR Value 500p
SYMBOL res 2576 -1488 M90
WINDOW 0 0 56 VBottom 2
WINDOW 3 32 56 VTop 2
SYMATTR InstName R56
SYMATTR Value 4.7k
SYMBOL res 2736 -1440 M0
SYMATTR InstName R57
SYMATTR Value 470
SYMBOL res 2512 -1248 M0
SYMATTR InstName R58
SYMATTR Value 470
SYMBOL cap 2224 -1280 R90
WINDOW 0 0 32 VBottom 2
WINDOW 3 32 32 VTop 2
SYMATTR InstName C21
SYMATTR Value 500p
SYMBOL pnp 2880 -1488 M180
SYMATTR InstName Q29
SYMATTR Value 2N3906
SYMBOL res 2864 -1552 R90
WINDOW 0 0 56 VBottom 2
WINDOW 3 32 56 VTop 2
SYMATTR InstName R59
SYMATTR Value 4.7k
SYMBOL res 2960 -1312 M0
SYMATTR InstName R60
SYMATTR Value 1k
SYMBOL pnp -1088 -1632 M180
SYMATTR InstName Q30
SYMATTR Value 2N3906
SYMBOL res -1104 -1696 R90
WINDOW 0 0 56 VBottom 2
WINDOW 3 32 56 VTop 2
SYMATTR InstName R61
SYMATTR Value 4.7k
SYMBOL pnp 96 -1632 M180
SYMATTR InstName Q31
SYMATTR Value 2N3906
SYMBOL res 80 -1696 R90
WINDOW 0 0 56 VBottom 2
WINDOW 3 32 56 VTop 2
SYMATTR InstName R62
SYMATTR Value 4.7k
SYMBOL pnp 1104 -1632 M180
SYMATTR InstName Q32
SYMATTR Value 2N3906
SYMBOL res 1088 -1696 R90
WINDOW 0 0 56 VBottom 2
WINDOW 3 32 56 VTop 2
SYMATTR InstName R63
SYMATTR Value 4.7k
SYMBOL pnp 2112 -1632 M180
SYMATTR InstName Q33
SYMATTR Value 2N3906
SYMBOL res 2096 -1696 R90
WINDOW 0 0 56 VBottom 2
WINDOW 3 32 56 VTop 2
SYMATTR InstName R64
SYMATTR Value 4.7k
SYMBOL res 3200 -1264 R90
WINDOW 0 0 56 VBottom 2
WINDOW 3 32 56 VTop 2
SYMATTR InstName R65
SYMATTR Value 4.7k
SYMBOL res 3408 -1104 R90
WINDOW 0 0 56 VBottom 2
WINDOW 3 32 56 VTop 2
SYMATTR InstName R66
SYMATTR Value 4.7k
SYMBOL npn 3200 -1296 R0
SYMATTR InstName Q34
SYMATTR Value 2N3904
SYMBOL npn 3408 -1136 R0
SYMATTR InstName Q35
SYMATTR Value 2N3904
SYMBOL res 3280 -1744 M0
SYMATTR InstName R67
SYMATTR Value 1k
SYMBOL npn 3712 -1328 R0
SYMATTR InstName Q36
SYMATTR Value 2N3904
SYMBOL res 3664 -1296 R90
WINDOW 0 0 56 VBottom 2
WINDOW 3 32 56 VTop 2
SYMATTR InstName R68
SYMATTR Value 4.7k
SYMBOL res 3792 -1760 M0
SYMATTR InstName R69
SYMATTR Value 1k
SYMBOL pnp -1584 -1664 M180
SYMATTR InstName Q37
SYMATTR Value 2N3906
SYMBOL pnp -1584 -1472 M180
SYMATTR InstName Q38
SYMATTR Value 2N3906
SYMBOL res -1504 -1088 M0
SYMATTR InstName R70
SYMATTR Value 1k
SYMBOL res -1648 -1536 R90
WINDOW 0 0 56 VBottom 2
WINDOW 3 32 56 VTop 2
SYMATTR InstName R71
SYMATTR Value 10k
SYMBOL voltage -2096 -1584 R180
WINDOW 0 24 96 Left 2
WINDOW 3 24 16 Left 2
WINDOW 123 0 0 Left 0
WINDOW 39 0 0 Left 0
SYMATTR InstName ENA1
SYMATTR Value 6
SYMBOL res -1632 -1728 R90
WINDOW 0 0 56 VBottom 2
WINDOW 3 32 56 VTop 2
SYMATTR InstName R72
SYMATTR Value 10k
SYMBOL pnp -1168 576 M180
SYMATTR InstName Q39
SYMATTR Value 2N3906
SYMBOL res -1200 512 R90
WINDOW 0 0 56 VBottom 2
WINDOW 3 32 56 VTop 2
SYMATTR InstName R73
SYMATTR Value 1k
SYMBOL res -1088 224 M0
SYMATTR InstName R74
SYMATTR Value 4.7k
TEXT -568 -184 Left 6 ;Divide-by-6 counter
TEXT 2984 384 Left 5 ;Carry out\ncount = 10
TEXT -1576 -56 Left 5 ;ENABLE\n-6V level
TEXT 2976 -144 Left 5 ;Reset
TEXT 736 1216 Left 5 ;Bit 0
TEXT 1744 1200 Left 5 ;Bit 1
TEXT 2776 1200 Left 5 ;Bit 2
TEXT -936 -1944 Left 2 !.tran 1500u
TEXT -1272 -2072 Left 6 ;Divide-by-10 counter
TEXT 3304 -1504 Left 5 ;Carry out\ncount = 10
TEXT -2280 -1248 Left 5 ;COUNT\n-6V 5us+
TEXT -2280 -1944 Left 5 ;ENABLE\n-6V level
TEXT 3280 -2032 Left 5 ;Reset
TEXT 32 -672 Left 5 ;Bit 0
TEXT 1040 -688 Left 5 ;Bit 1
TEXT 2072 -688 Left 5 ;Bit 2
TEXT 3096 -696 Left 5 ;Bit 3

The netlist it stands for:
* counter_div60.asc
Q1 QN N042 0 0 2N3906
C1 N043 QN 500p
R1 N043 QN 4.7k
R2 QN N062 470
Q2 Q N043 0 0 2N3906
C2 N042 Q 500p
R3 N042 Q 4.7k
R4 Q N062 470
R5 N062 N037 470
C3 N062 N061 500p
Q3 VOUT N053 0 0 2N3906
R6 N053 Q 4.7k
R7 VOUT N037 1k
Q4 QN1 N045 0 0 2N3906
C4 N046 QN1 500p
R8 N046 QN1 4.7k
R9 QN1 N063 470
Q5 Q1 N046 0 0 2N3906
C5 N045 Q1 500p
R10 N045 Q1 4.7k
R11 Q1 N063 470
R12 N063 N037 470
C6 N063 VOUT 500p
Q6 VOUT1 N054 0 0 2N3906
R13 N054 Q1 4.7k
R14 VOUT1 N037 1k
Q7 N050 N048 0 0 2N3906
C7 N049 N050 500p
R15 N049 N050 4.7k
R16 N050 N064 470
Q8 N052 N049 0 0 2N3906
C8 N048 N052 500p
R17 N048 N052 4.7k
R18 N052 N064 470
R19 N064 N037 470
C9 N064 VOUT1 500p
Q9 N058 N055 0 0 2N3906
R20 N055 N052 4.7k
R21 N058 N037 1k
Q13 QN N041 0 0 2N3906
R29 N041 N038 4.7k
Q14 QN1 N044 0 0 2N3906
R30 N044 N038 4.7k
Q15 N050 N047 0 0 2N3906
R31 N047 N038 4.7k
R34 N065 N058 4.7k
R35 N066 VOUT1 4.7k
Q17 CY9 N065 N037 0 2N3904
Q18 CY9 N066 N037 0 2N3904
R36 0 CY9 1k
Q19 N038 N060 N037 0 2N3904
R37 N060 CY9 4.7k
R38 0 N038 1k
Q20 N051 N040 0 0 2N3906
Q21 N061 N057 N051 0 2N3906
R39 N061 N037 1k
R40 N057 N056 1k
V§ENA 0 N039 6
R41 N040 N039 10k
Q10 QN N005 0 0 2N3906
C10 N006 QN 500p
R22 N006 QN 4.7k
R23 QN N031 470
Q11 Q N006 0 0 2N3906
C11 N005 Q 500p
R24 N005 Q 4.7k
R25 Q N031 470
R26 N031 N037 470
C12 N031 N030 500p
V2 0 N037 6
VIN1 0 N025 PULSE(6 0 10u 50n 50n 10u 20u 500)
Q12 VOUT N021 0 0 2N3906
R27 N021 Q 4.7k
R28 VOUT N037 1k
Q16 QN1 N008 0 0 2N3906
C13 N009 QN1 500p
R32 N009 QN1 4.7k
R33 QN1 N032 470
Q22 Q1 N009 0 0 2N3906
C14 N008 Q1 500p
R42 N008 Q1 4.7k
R43 Q1 N032 470
R44 N032 N037 470
C15 N032 VOUT 500p
Q23 VOUT1 N022 0 0 2N3906
R45 N022 Q1 4.7k
R46 VOUT1 N037 1k
Q24 N016 N011 0 0 2N3906
C16 N012 N016 500p
R47 N012 N016 4.7k
R48 N016 N033 470
Q25 N019 N012 0 0 2N3906
C17 N011 N019 500p
R49 N011 N019 4.7k
R50 N019 N033 470
R51 N033 N037 470
C18 N033 VOUT1 500p
Q26 N027 N023 0 0 2N3906
R52 N023 N019 4.7k
R53 N027 N037 1k
Q27 N017 N014 0 0 2N3906
C19 N015 N017 500p
R54 N015 N017 4.7k
R55 N017 N034 470
Q28 N020 N015 0 0 2N3906
C20 N014 N020 500p
R56 N014 N020 4.7k
R57 N020 N034 470
R58 N034 N037 470
C21 N034 N027 500p
Q29 N028 N024 0 0 2N3906
R59 N024 N020 4.7k
R60 N028 N037 1k
Q30 QN N004 0 0 2N3906
R61 N004 N001 4.7k
Q31 QN1 N007 0 0 2N3906
R62 N007 N001 4.7k
Q32 N016 N010 0 0 2N3906
R63 N010 N001 4.7k
Q33 N017 N013 0 0 2N3906
R64 N013 N001 4.7k
R65 N035 N028 4.7k
R66 N036 VOUT1 4.7k
Q34 CY9 N035 N037 0 2N3904
Q35 CY9 N036 N037 0 2N3904
R67 0 CY9 1k
Q36 N001 N029 N037 0 2N3904
R68 N029 CY9 4.7k
R69 0 N001 1k
Q37 N018 N003 0 0 2N3906
Q38 N030 N026 N018 0 2N3906
R70 N030 N037 1k
R71 N026 N025 10k
V§ENA1 0 N002 6
R72 N003 N002 10k
Q39 N037 N059 N056 0 2N3906
R73 N059 N028 1k
R74 0 N056 4.7k
.model NPN NPN
.model PNP PNP
.lib standard.bjt
* Divide-by-6 counter
* Carry out
* count = 10
* ENABLE
* -6V level
* Reset
* Bit 0
* Bit 1
* Bit 2
.tran 1500u
* Divide-by-10 counter
* Carry out
* count = 10
* COUNT
* -6V 5us+
* ENABLE
* -6V level
* Reset
* Bit 0
* Bit 1
* Bit 2
* Bit 3
.backanno
.end